# Altium schematic sheet Supply.SchDoc
size A4; SheetNumber: 8; SheetTotal: 8
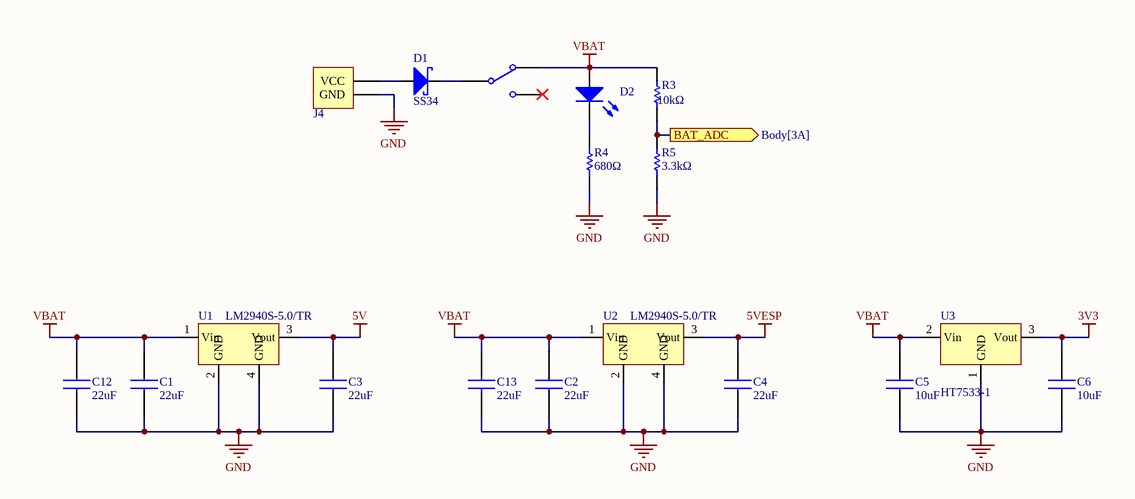
[diagram p0: Supply.SchDoc]

## Parts
C1  value 22uF  [CAP0805]  (hidden comment: CL21A226MAQNNNE)
C2  value 22uF  [CAP0805]  (hidden comment: CL21A226MAQNNNE)
C3  value 22uF  [CAP0805]  (hidden comment: CL21A226MAQNNNE)
C4  value 22uF  [CAP0805]  (hidden comment: CL21A226MAQNNNE)
C5  value 10uF  [CAP0805]  (hidden comment: GRM21BR61H106KE43L)
C6  value 10uF  [CAP0805]  (hidden comment: GRM21BR61H106KE43L)
C12  value 22uF  [CAP0805]  (hidden comment: CL21A226MAQNNNE)
C13  value 22uF  [CAP0805]  (hidden comment: CL21A226MAQNNNE)
D1  SS34  [SMA_L4.3-W2.6-LS5.2-RD]
D2  KT-0805G  [LED0805]  (value not drawn)
J4  BATTERY  [XT30]  (value not drawn)
R3  value 10kΩ  [RES0805]  (hidden comment: 0805W8F1002T5E)
R4  value 680Ω  [RES0805]  (hidden comment: 0805W8F6800T5E)
R5  value 3.3kΩ  [RES0805]  (hidden comment: 0805W8F3301T5E)
SW1  SS12D10G4 071  [SW-TH_SHOU-HAN_SS12D10G4]  (value not drawn)
U1  LM2940S-5.0/TR  [TO-263-3_L8.6-W10.2-P2.54-LS14.4-BR]
U2  LM2940S-5.0/TR  [TO-263-3_L8.6-W10.2-P2.54-LS14.4-BR]
U3  HT7533-1  [SOT-89-3_L4.5-W2.5-P1.50-LS4.2-BR]

## Ports
BAT_ADC (out, see Body[3A])

## Nets
3V3: C6.2 U3.3(Vout)
5V: C3.2 U1.3(Vout)
5VESP: C4.2 U2.3(Vout)
GND: C1.1 C2.1 C3.1 C4.1 C5.1 C6.1 C12.1 C13.1 J4.2(GND) R4.1 R5.1 U1.2(GND) U1.4(GND) U2.2(GND) U2.4(GND) U3.1(GND)
VBAT: C1.2 C2.2 C5.2 C12.2 C13.2 D2.A R3.2 SW1.1 U1.1(Vin) U2.1(Vin) U3.2(Vin)
BAT_ADC: R3.1 R5.2 ; port BAT_ADC
NetD1_A: D1.A J4.1(VCC)
NetD1_C: D1.C SW1.2(COMMON)
NetD2_K: D2.K R4.2

Not connected (* = marked no-connect by the designer): SW1 3(NO)*

## Library data of the parts
C1-C4 C12 C13 = CL21A226MAQNNNE: 25V 22uF X5R ±20% 0805 Multilayer Ceramic Capacitors MLCC - SMD/SMT ROHS; Manufacturer_Name: Samsung Electro-Mechanics; Geometry.Height: 0.95mm; Manufacturer_Part_Number: CL21A226MAQNNNE; LCSC: C45783; ComponentLink1Description: JLCPCB; ComponentLink1URL: https://jlcpcb.com/partdetail/46786-CL21A226MAQNNNE/C45783; ComponentLink2Description: Datasheet; ComponentLink2URL: https://www.lcsc.com/datasheet/lcsc_datasheet_2304140030_Samsung-Electro-Mechanics-CL21A226MAQNNNE_C45783.pdf
C5 C6 = GRM21BR61H106KE43L: 50V 10uF X5R ±10% 0805 Multilayer Ceramic Capacitors MLCC - SMD/SMT ROHS; Manufacturer: Murata Electronics; Geometry.Height: 0.95mm; Part Number: GRM21BR61H106KE43L; LCSC: C440198; ComponentLink1Description: Datasheet; ComponentLink1URL: https://www.lcsc.com/datasheet/lcsc_datasheet_2310251059_Murata-Electronics-GRM21BR61H106KE43L_C440198.pdf; ComponentLink2Description: JLCPCB; ComponentLink2URL: https://jlcpcb.com/partdetail/439567-GRM21BR61H106KE43L/C440198; Rated Voltage: 50V
D1 = SS34: 40V Independent Type 3A 550mV@3A SMA(DO-214AC) Schottky Diodes ROHS; Manufacturer: MDD(Microdiode Semiconductor); Max Forward Surge Current (Ifsm): 80 A; Current - Reverse Leakage @ Vr: 500 mA; Voltage - Forward (Vf) (Max) @ If: 550 mV; Diode Type: Schottky Barrier Rectifier; Part Number: SS34; Category: Schottky Diodes & Rectifiers; Package / Case: SMA(DO-214AC); Current - Average Rectified (Io): 3 A; Operating Temperature: - 55ºC ~ 125ºC; Voltage - DC Reverse (Vr) (Max): 40 V; ComponentLink1Description: JLCPCB; ComponentLink1URL: https://jlcpcb.com/partdetail/mdd_microdiode_semiconductor-SS34/C8678; ComponentLink2Description: Datasheet; ComponentLink2URL: https://www.lcsc.com/datasheet/lcsc_datasheet_2407101107_MDD-Microdiode-Semiconductor-SS34_C8678.pdf; LCSC: C8678
D2 = KT-0805G: Emerald 0805 LED Indication - Discrete ROHS; Manufacturer: Hubei KENTO Elec; Color: Green; Current - Forward (If): 20mA; Voltage - Forward (Vf): 2.6V; LCSC: C2297; Package / Case: 0805; ComponentLink2Description: Datasheet; ComponentLink2URL: https://www.lcsc.com/datasheet/lcsc_datasheet_1806151129_Hubei-KENTO-Elec-KT-0805Y_C2296.pdf
J4 = XT30: CONN BATTERY HORZ 2POS XT30; Library Control - Checked Footprint: Under review; Library Control - Checked Schematic: Yes; Library Control - Last Project that Used: Follow-Final; Library Control - Person that Checked Footprint: Lucas; Library Control - Person that did the Last Update Footprint: Mateus(Dimas); Library Control - Last Update: 24/04/2021 00:25; Library Control - Person that Checked Schematic: Lucas; Library Control - Person that did the Last Update Schematic: Mateus(Dimas); ComponentLink1Description: Supplier Link; ComponentLink1URL: https://www.gobilda.com/right-angle-pcb-mount-xt30-connector-mh-fc-2-pack/
R3 = 0805W8F1002T5E: 125mW Thick Film Resistors 150V ±100ppm/℃ ±1% 10kΩ 0805 Chip Resistor - Surface Mount ROHS; Manufacturer_Name: UNI-ROYAL; Geometry.Height: 0.95mm; Manufacturer_Part_Number: 0805W8F1002T5E; Datasheet Link: https://wmsc.lcsc.com/wmsc/upload/file/pdf/v2/lcsc/2206010216_UNI-ROYAL-Uniroyal-Elec-0805W8F1002T5E_C17414.pdf; LCSC: C17414
R4 = 0805W8F6800T5E: 125mW Thick Film Resistors 150V ±100ppm/℃ ±1% 680Ω 0805 Chip Resistor - Surface Mount ROHS; Manufacturer_Name: UNI-ROYAL; Geometry.Height: 0.95mm; Part Number: 0805W8F6800T5E; LCSC: C17798; ComponentLink1Description: Datasheet Link; ComponentLink1URL: https://www.lcsc.com/datasheet/lcsc_datasheet_2205311830_UNI-ROYAL-Uniroyal-Elec-0805W8F6800T5E_C17798.pdf
R5 = 0805W8F3301T5E: 125mW Thick Film Resistors 150V ±100ppm/℃ ±1% 3.3kΩ 0805 Chip Resistor - Surface Mount ROHS; Manufacturer_Name: UNI-ROYAL; Geometry.Height: 0.95mm; Manufacturer_Part_Number: 0805W8F3301T5E; Datasheet Link: https://wmsc.lcsc.com/wmsc/upload/file/pdf/v2/lcsc/2206010045_UNI-ROYAL-Uniroyal-Elec-0805W8F3301T5E_C26010.pdf; LCSC: C26010
SW1 = SS12D10G4 071: Manufacturer: SHOU HAN(首韩); Add into BOM: yes; Circuit: SPDT; Pin Style: PCPin; Switch Length: 12.7mm; Switch Width: 6.7mm; Switch Height: 6.4mm; Current Rating (DC): 2A; Voltage Rating (DC): 125V; Mechanical Life: 3千次; Symbol: SS12D10G4 071; Device: SS12D10G4 071; LCSC Part Name: SS12D10G4 071; LCSC: C2887259; Manufacturer Part: SS12D10G4 071; Supplier Footprint: 插件; JLCPCB Part Class: Extended Part; Datasheet: https://atta.szlcsc.com/upload/public/pdf/source/20210820/80D1704BBF3FCEE0435FCAA54C61E0A3.pdf; Supplier: LCSC; Convert to PCB: yes; Actuator Style: -; Mounting Style: Straight; Actuator Color: -; Current Rating (AC): -; Voltage Rating (AC): -; Operating Temperature: -16℃~+60℃
U1 U2 = LM2940S-5.0/TR: 1A 60dB@(120Hz) Fixed 5V Positive electrode 26V TO-263-3L Voltage Regulators - Linear, Low Drop Out (LDO) Regulators ROHS; Manufacturer: HGSEMI; Voltage - Dropout (Max): 21 V; Part Number: LM2940S-5.0/TR; Package/ Case: TO-263-3; Operating Temperature: 0~125 ºC; Output Type: Fixed; Voltage - Input (Max): 26 V; Voltage - Output (Min/Fixed): 5 V; LCSC: C434496; Current - Output: 1 A; ComponentLink2Description: Datasheet; ComponentLink2URL: https://www.lcsc.com/datasheet/lcsc_datasheet_2201242200_HGSEMI-LM2940S-5-0-TR_C434496.pdf; ComponentLink3Description: JLCPCB; ComponentLink3URL: https://jlcpcb.com/partdetail/Hgsemi-LM2940S_5_0TR/C434496
U3 = HT7533-1: 100mA Fixed 3.3V Positive electrode 30V SOT-89-3 Voltage Regulators - Linear, Low Drop Out (LDO) Regulators ROHS; Manufacturer: Holtek Semicon; Max Power Dissipation: 500 mW; Current - Quiescent (Iq): 8mA; Voltage - Dropout (Max): 26.7 V; Part Number: HT7533-1; Package/ Case: SOT-89-3; Operating Temperature: -40~85 ºC; Output Type: Fixed; Voltage - Input (Max): 30 V; Voltage - Output (Min/Fixed): 3.3 V; LCSC: C14289; Current - Output: 100 mA; ComponentLink2Description: Datasheet; ComponentLink2URL: https://www.lcsc.com/datasheet/lcsc_datasheet_2312191111_Holtek-Semicon-HT7533-1_C14289.pdf; ComponentLink3Description: JLCPCB; ComponentLink3URL: https://jlcpcb.com/partdetail/HoltekSemicon-HT75331/C14289